# EAGLE schematic basic-BOARD-SD (EAGLE 7.2.0)
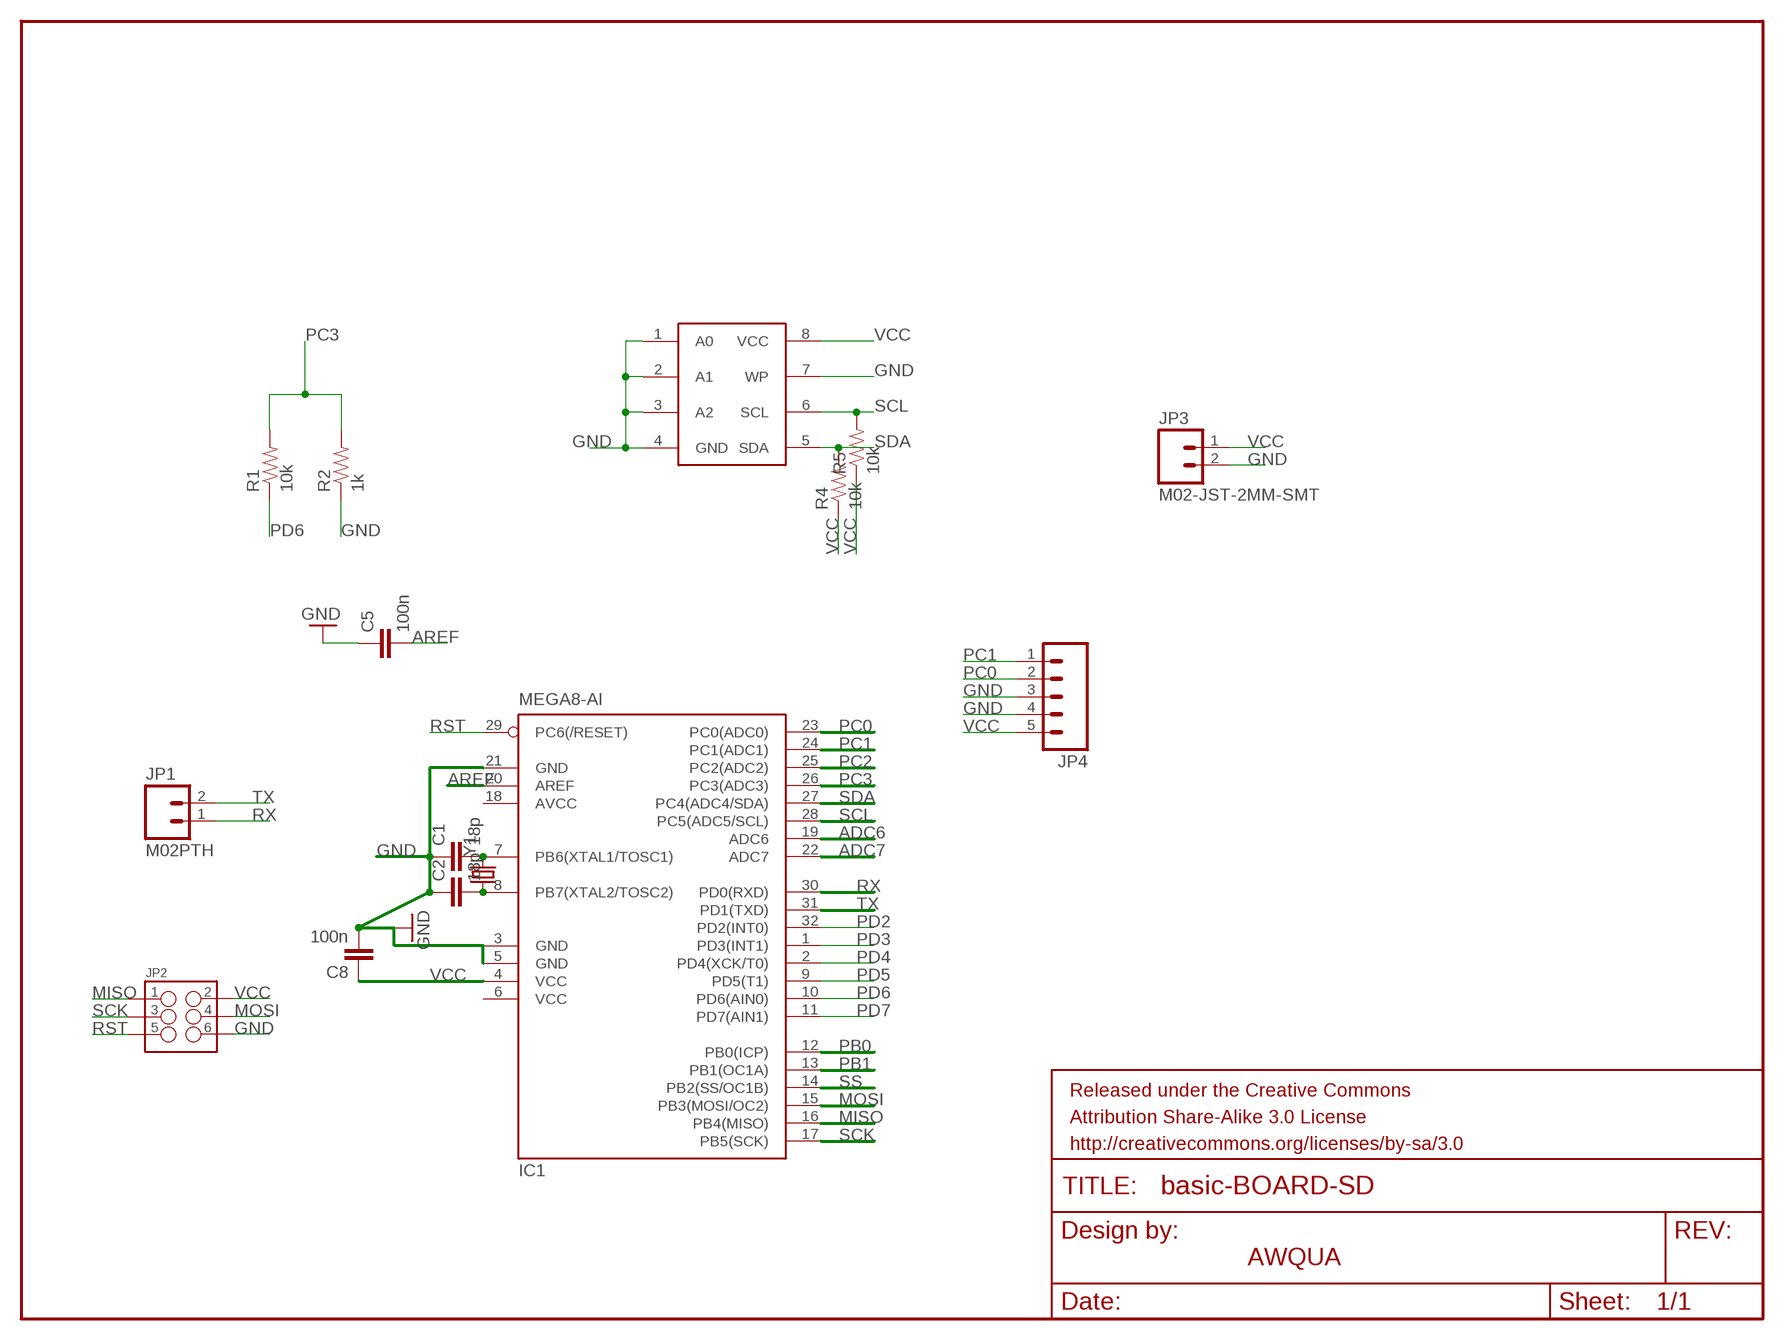
[diagram p0: schematic, sheet 1]

## Parts
C1  18p  CAP0603-CAP  [0603-CAP]
C2  18p  CAP0603-CAP  [0603-CAP]
C5  100n  CAP0603-CAP  [0603-CAP]
C8  100n  CAP0603-CAP  [0603-CAP]
EEPROM  AT24C256  [SOIC8-LONGPAD]
FRAME1  FRAME-LETTER  [CREATIVE_COMMONS]
IC1  MEGA8-AI  [TQFP32-08]
JP1  M02PTH  [1X02]
JP2  M03X22X3_SILK_SM  [2X3]
JP3  M02-JST-2MM-SMT  [JST-2-SMD]
JP4  M05PTH  [1X05]
R1  10k  RESISTOR0603  [0603-RES]
R2  1k  RESISTOR0603  [0603-RES]
R4  10k  RESISTOR0603  [0603-RES]
R5  10k  RESISTOR0603  [0603-RES]
Y1  CRYSTAL5X3  [CRYSTAL-SMD-5X3]

## Nets
ADC6: IC1.19(ADC6)
ADC7: IC1.22(ADC7)
AREF: C5.2 IC1.20(AREF)
GND: C1.1 C2.1 C5.1 C8.2 EEPROM.1(A0) EEPROM.2(A1) EEPROM.3(A2) EEPROM.4(GND) EEPROM.7(WP) IC1.3(GND) IC1.5(GND) IC1.21(GND) JP2.6 JP3.2 JP4.3 JP4.4 R2.1
MISO: IC1.16(PB4(MISO)) JP2.1
MOSI: IC1.15(PB3(MOSI/OC2)) JP2.4
PB0: IC1.12(PB0(ICP))
PB1: IC1.13(PB1(OC1A))
PC0: IC1.23(PC0(ADC0)) JP4.2
PC1: IC1.24(PC1(ADC1)) JP4.1
PC2: IC1.25(PC2(ADC2))
PC3: IC1.26(PC3(ADC3)) R1.2 R2.2
PD2: IC1.32(PD2(INT0))
PD3: IC1.1(PD3(INT1))
PD4: IC1.2(PD4(XCK/T0))
PD5: IC1.9(PD5(T1))
PD6: IC1.10(PD6(AIN0)) R1.1
PD7: IC1.11(PD7(AIN1))
Q1: C2.2 IC1.8(PB7(XTAL2/TOSC2)) Y1.1
Q2: C1.2 IC1.7(PB6(XTAL1/TOSC1)) Y1.3
RST: IC1.29(PC6(/RESET)) JP2.5
RX: IC1.30(PD0(RXD)) JP1.1
SCK: IC1.17(PB5(SCK)) JP2.3
SCL: EEPROM.6(SCL) IC1.28(PC5(ADC5/SCL)) R5.2
SDA: EEPROM.5(SDA) IC1.27(PC4(ADC4/SDA)) R4.2
SS: IC1.14(PB2(SS/OC1B))
TX: IC1.31(PD1(TXD)) JP1.2
VCC: C8.1 EEPROM.8(VCC) IC1.4(VCC) JP2.2 JP3.1 JP4.5 R4.1 R5.1

## Notes on the sheet
- AWQUA

## Power pins joined to a net without a drawn wire
AVCC: IC1.18(AVCC)
VCC: IC1.6(VCC)

## Library data of the parts
C1 C2 C5 C8 = SparkFun:CAP: Capacitor Standard 0603 ceramic capacitor, and 0.1" leaded capacitor.
EEPROM = open_source_turbidimeter:AT24C256
FRAME1 = SparkFun-Aesthetics:FRAME-LETTER: Schematic Frame Standard 8.5x11 US Letter frame
IC1 = atmel:MEGA8: MICROCONTROLLER 8 Kbytes FLASH, 1 kbytes SRAM, 512 bytes EEPROM, USART, 6-channel 10 bit ADC, 2-channel 8 bit ADC Pin compatible with Atmega48, ATMega88, ATMega168 Source: avr.lbr; MPN: ATMEGA8-16AU; OC_FARNELL: 9171371; OC_NEWARK: 73M8863
JP1 = SparkFun-Connectors:M02: Standard 2-pin 0.1" header. Use with - straight break away headers ( PRT-00116) - right angle break away headers (PRT-00553) - swiss pins (PRT-00743) - machine pins (PRT-00117) - female headers (PRT-00115) Molex polarized connector foot print use with: PRT-08233 with associated crimp pins and housings. 2.54_SCREWTERM for use with PRT-10571. 3.5mm Screw Terminal footprints for PRT-08084 5mm Screw Terminal footprints for use with PRT-08433
JP2 = SparkFun-Connectors:M03X2: 2x3 .1" header. Shrouded, with keying- CONN-10681 SMT- CONN-11415 Pogo pins- HW-11044
JP3 = SparkFun-Connectors:M02: Standard 2-pin 0.1" header. Use with - straight break away headers ( PRT-00116) - right angle break away headers (PRT-00553) - swiss pins (PRT-00743) - machine pins (PRT-00117) - female headers (PRT-00115) Molex polarized connector foot print use with: PRT-08233 with associated crimp pins and housings. 2.54_SCREWTERM for use with PRT-10571. 3.5mm Screw Terminal footprints for PRT-08084 5mm Screw Terminal footprints for use with PRT-08433; PROD_ID: CONN-08352
JP4 = SparkFun-Connectors:M05: Header 5 Standard 5-pin 0.1" header. Use with straight break away headers (SKU : PRT-00116), right angle break away headers (PRT-00553), swiss pins (PRT-00743), machine pins (PRT-00117), and female headers (PRT-00115). Molex polarized connector foot print use with SKU : PRT-08230 with associated crimp pins and housings.
R1 R2 R4 R5 = SparkFun-Resistors:RESISTOR: Resistor Basic schematic elements and footprints for 0603, 1206, and PTH resistors.
Y1 = SparkFun:CRYSTAL: Crystals Various standard crystals. Proven footprints. Spark Fun Electronics SKU : COM-00534